# EAGLE schematic esp32buscam_02 (EAGLE 9.6.2)
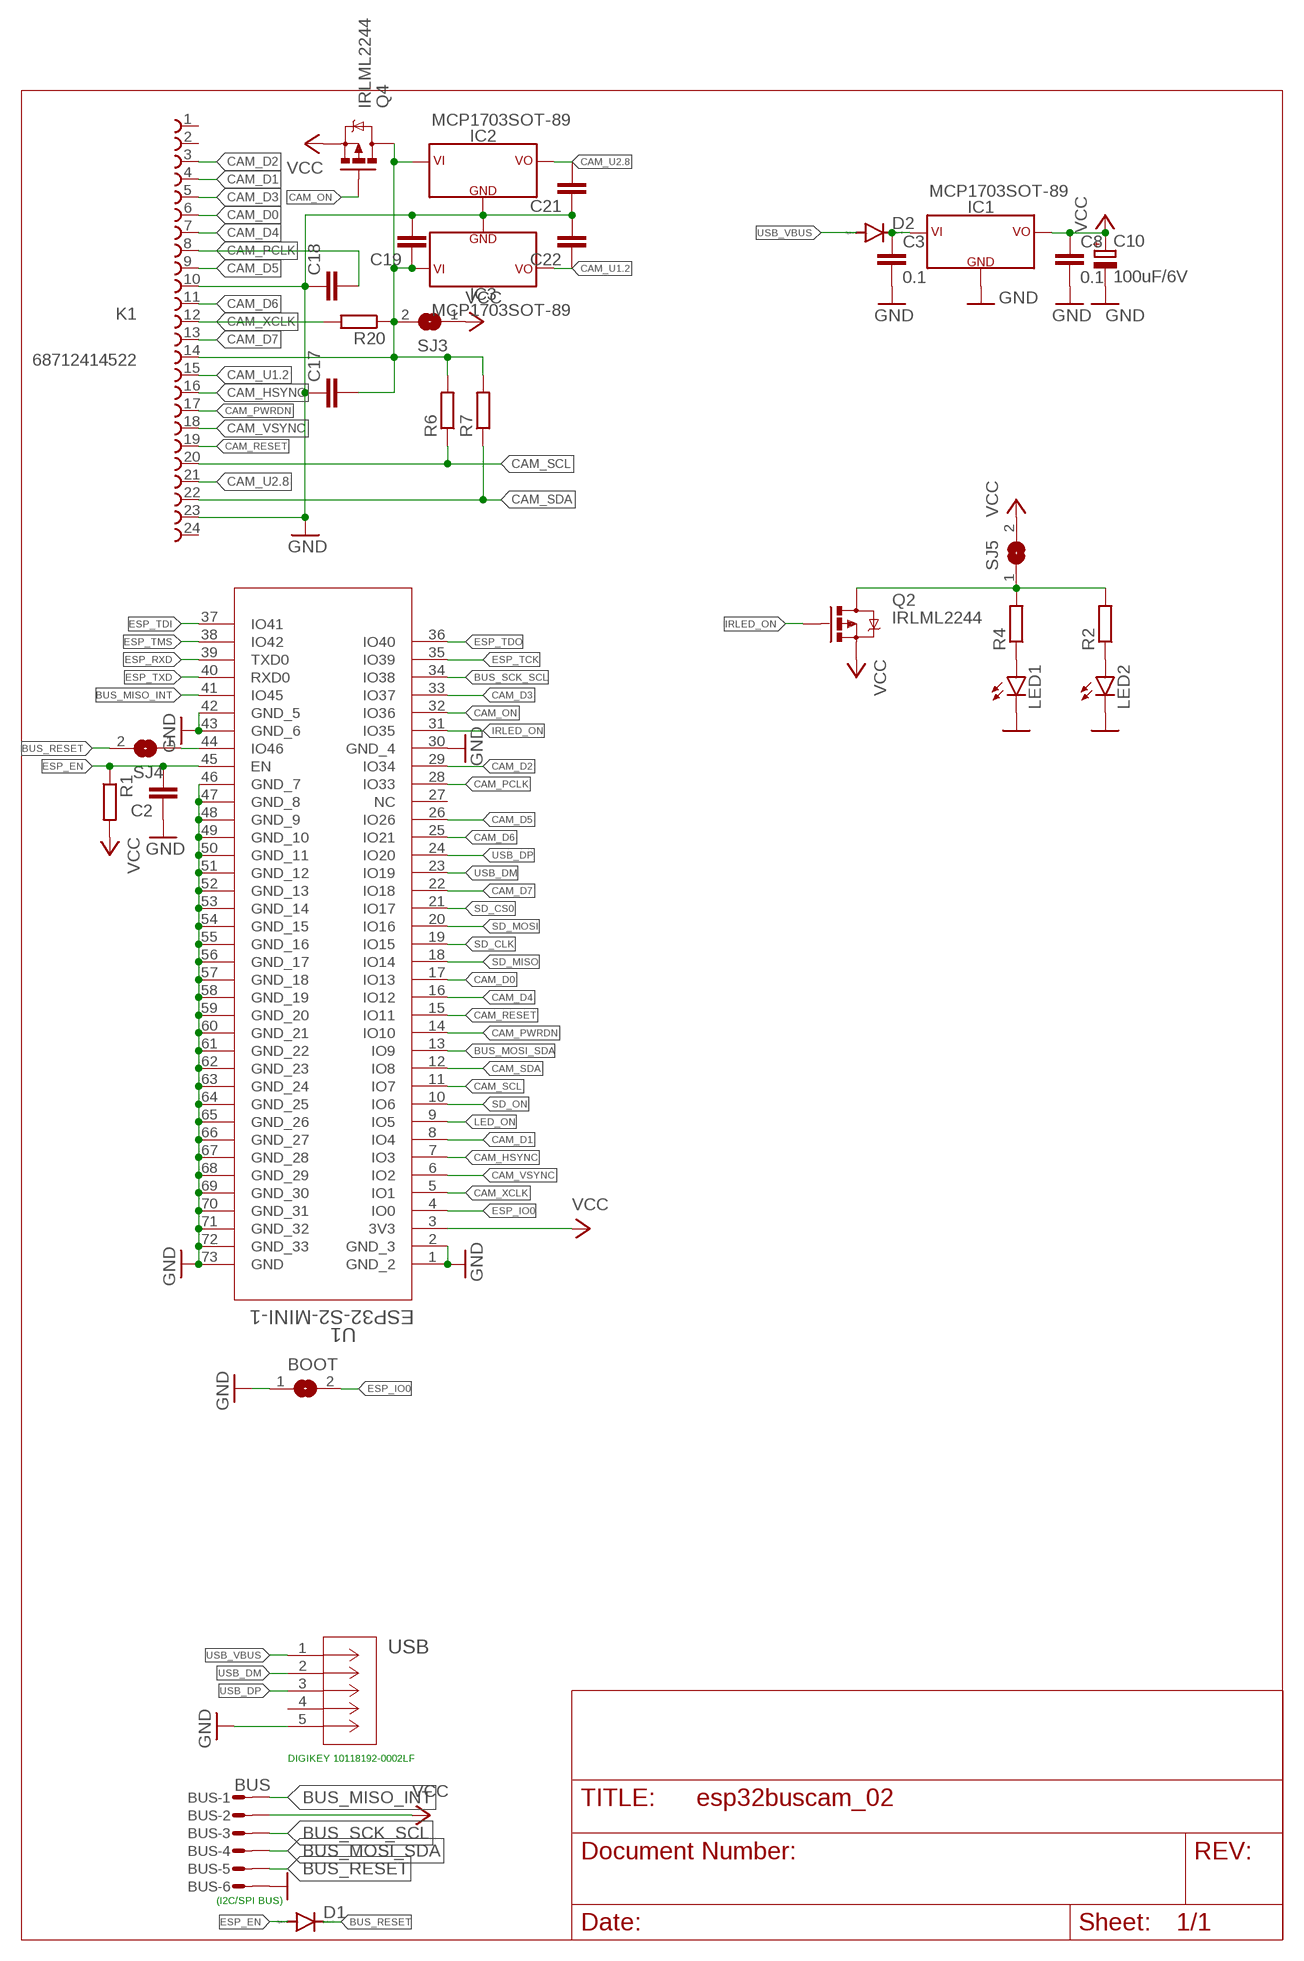
[diagram p0: schematic, sheet 1]

## Parts
BOOT  SJ  [SJ]
BUS  BUS  MICROMATCH-6SMD  [MICROMATCH-6SMD]
C2  C-EUC0603  [C0603]
C3  0.1  C-EUC0805  [C0805]
C8  0.1  C-EUC0805  [C0805]
C10  100uF/6V  CPOL-EUB/3528-21R  [B/3528-21R]
C17  C-EUC0603  [C0603]
C18  C-EUC0603  [C0603]
C19  C-EUC0603  [C0603]
C21  C-EUC0603  [C0603]
C22  C-EUC0603  [C0603]
D1  DIODE-MINIMELF  [MINIMELF]
D2  DIODE-MINIMELF  [MINIMELF]
IC1  MCP1703SOT-89  [SOT89]
IC2  MCP1703SOT-89  [SOT89]
IC3  MCP1703SOT-89  [SOT89]
K1  68712414522  [68712414522]
LED1  LED5MM  [LED5MM]
LED2  LED5MM  [LED5MM]
Q2  IRLML2244  MOSFET-PCHANNELIRLML2244  [SOT23-3]
Q4  IRLML2244  MOSFET-PCHANNELIRLML2244  [SOT23-3]
R1  R-EU_R0603  [R0603]
R2  R-EU_R0402  [R0402]
R4  R-EU_R0402  [R0402]
R6  R-EU_R0603  [R0603]
R7  R-EU_R0603  [R0603]
R20  R-EU_R0603  [R0603]
SJ3  SJ  [SJ]
SJ4  SJ  [SJ]
SJ5  SJ  [SJ]
U1  ESP32-S2-MINI-1  [QFN60_ESP32-S2-MINI-1_EXP]
USB  10118192-0002LF  [CONN_10118192-0002LF_AMP]

## Nets
BUS_MISO_INT: BUS.1 U1.41(IO45)
BUS_MOSI_SDA: BUS.4 U1.13(IO9)
BUS_RESET: BUS.5 D1.C SJ4.2
BUS_SCK_SCL: BUS.3 U1.34(IO38)
CAM_D0: K1.6 U1.17(IO13)
CAM_D1: K1.4 U1.8(IO4)
CAM_D2: K1.3 U1.29(IO34)
CAM_D3: K1.5 U1.33(IO37)
CAM_D4: K1.7 U1.16(IO12)
CAM_D5: K1.9 U1.26(IO26)
CAM_D6: K1.11 U1.25(IO21)
CAM_D7: K1.13 U1.22(IO18)
CAM_HSYNC: K1.16 U1.7(IO3)
CAM_ON: Q4.1(G) U1.32(IO36)
CAM_PCLK: C18.2 K1.8 U1.28(IO33)
CAM_PWRDN: K1.17 U1.14(IO10)
CAM_RESET: K1.19 U1.15(IO11)
CAM_SCL: K1.20 R6.1 U1.11(IO7)
CAM_SDA: K1.22 R7.1 U1.12(IO8)
CAM_U1.2: C22.1 IC3.3(VCC) K1.15
CAM_U2.8: C21.2 IC2.3(VCC) K1.21
CAM_VSYNC: K1.18 U1.6(IO2)
CAM_XCLK: K1.12 R20.2 U1.5(IO1)
ESP_EN: C2.2 D1.A R1.1 U1.45(EN)
ESP_IO0: BOOT.2 U1.4(IO0)
ESP_RXD: U1.39(TXD0)
ESP_TCK: U1.35(IO39)
ESP_TDI: U1.37(IO41)
ESP_TDO: U1.36(IO40)
ESP_TMS: U1.38(IO42)
ESP_TXD: U1.40(RXD0)
GND [gnd]: BOOT.1 BUS.6 C2.1 C3.2 C8.2 C10.- C17.1 C18.1 C19.2 C21.1 C22.2 IC1.1(GND) IC2.1(GND) IC3.1(GND) K1.10 K1.23 LED1.K(C) LED2.K(C) U1.1(GND_2) U1.2(GND_3) U1.30(GND_4) U1.42(GND_5) U1.43(GND_6) U1.46(GND_7) U1.47(GND_8) U1.48(GND_9) U1.49(GND_10) U1.50(GND_11) U1.51(GND_12) U1.52(GND_13) U1.53(GND_14) U1.54(GND_15) U1.55(GND_16) U1.56(GND_17) U1.57(GND_18) U1.58(GND_19) U1.59(GND_20) U1.60(GND_21) U1.61(GND_22) U1.62(GND_23) U1.63(GND_24) U1.64(GND_25) U1.65(GND_26) U1.66(GND_27) U1.67(GND_28) U1.68(GND_29) U1.69(GND_30) U1.70(GND_31) U1.71(GND_32) U1.72(GND_33) U1.73(GND) USB.5
IRLED_ON: Q2.1(G) U1.31(IO35)
LED_ON: U1.9(IO5)
N$1: LED1.A R4.1
N$2: SJ4.1 U1.44(IO46)
N$3: LED2.A R2.1
N$8: Q2.3(D) R2.2 R4.2 SJ5.1
SD_CLK: U1.19(IO15)
SD_CS0: U1.21(IO17)
SD_MISO: U1.18(IO14)
SD_MOSI: U1.20(IO16)
SD_ON: U1.10(IO6)
USB_DM: U1.23(IO19) USB.2
USB_DP: U1.24(IO20) USB.3
USB_VBUS [power]: D2.A USB.1
V [power]: C3.1 D2.C IC1.2(VIN) IC1.4(VIN)
VCC [power]: BUS.2 C8.1 C10.+ IC1.3(VCC) Q2.2(S) Q4.2(S) R1.2 SJ3.1 SJ5.2 U1.3(3V3)
VCC_CAM [power]: C17.2 C19.1 IC2.2(VIN) IC2.4(VIN) IC3.2(VIN) IC3.4(VIN) K1.14 Q4.3(D) R6.2 R7.2 R20.1 SJ3.2
Unconnected: K1.1 K1.2 K1.24 U1.27(NC) USB.4

## Notes on the sheet
- DIGIKEY 10118192-0002LF
- (I2C/SPI BUS)

## Library data of the parts
BOOT SJ3-SJ5 = jumper:SJ: SMD solder JUMPER
BUS = con-amp-micromatch:MICROMATCH-6: MicroMaTch 6 7-215464-6 / 0-215464-6 Drawing Number C-215464 DDEController.pdf
C2 C17-C19 C21 C22 = rcl:C-EU: CAPACITOR, European symbol; SPICEPREFIX: C
C3 C8 = rcl:C-EU: CAPACITOR, European symbol
C10 = rcl:CPOL-EU: POLARIZED CAPACITOR, European symbol
D1 D2 = diode:DIODE-: DIODE
IC1-IC3 = bytewerk-vreg:MCP1703
K1 = FPC_Connectors_Flat_Flexible_Cable_rev15c:68712414522: WE-FPC 0.5mm SMT ZIF Horizontal Bottom Contact, 24 Pins=>Code : Con_FPC_ZIF_0.50_68712414522 <http://katalog.we-online.de/media/images/eican/Con_FPC_ZIF_0.50_6871xx14522_pf2.jpg> Details see: http://katalog.we-online.de/en/em/687_1xx_145_22 Created 2014-07-09, Karrer Zheng 2014 (C) Würth Elektronik
LED1 LED2 = led:LED: LED OSRAM: - CHIPLED LG R971, LG N971, LY N971, LG Q971, LY Q971, LO R971, LY R971 LH N974, LH R974 LS Q976, LO Q976, LY Q976 LO Q996 - Hyper CHIPLED LW Q18S LB Q993, LB Q99A, LB R99A - SideLED LS A670, LO A670, LY A670, LG A670, LP A670 LB A673, LV A673, LT A673, LW A673 LH A674 LY A675 LS A676, LA A676, LO A676, LY A676, LW A676 LS A679, LY A679, LG A679 - Hyper Micro SIDELED® LS Y876, LA Y876, LO Y876, LY Y876 LT Y87S - SmartLED LW L88C, LW L88S LB L89C, LB L89S, LG L890 LS L89K, LO L89K, LY L89K LS L896, LA L896, LO L896, LY L896 - TOPLED LS T670, LO T670, LY T670, LG T670, LP T670 LSG T670, LSP T670, LSY T670, LOP T670, LYG T670 LG T671, LOG T671, LSG T671 LB T673, LV T673, LT T673, LW T673 LH T674 LS T676, LA T676, LO T676, LY T676, LB T676, LH T676, LSB T676, LW T676 LB T67C, LV T67C, LT T67C, LS T67K, LO T67K, LY T67K, LW E67C LS E67B, LA E67B, LO E67B, LY E67B, LB E67C, LV E67C, LT E67C LW T67C LS T679, LY T679, LG T679 LS T770, LO T770, LY T770, LG T770, LP T770 LB T773, LV T773, LT T773, LW T773 LH T774 LS E675, LA E675, LY E675, LS T675 LS T776, LA T776, LO T776, LY T776, LB T776 LHGB T686 LT T68C, LB T68C - Hyper Mini TOPLED® LB M676 - Mini TOPLED Santana® LG M470 LS M47K, LO M47K, LY M47K Source: http://www.osram.convergy.de LUXEON: - LUMILED® LXK2-PW12-R00, LXK2-PW12-S00, LXK2-PW14-U00, LXK2-PW14-V00 LXK2-PM12-R00, LXK2-PM12-S00, LXK2-PM14-U00 LXK2-PE12-Q00, LXK2-PE12-R00, LXK2-PE12-S00, LXK2-PE14-T00, LXK2-PE14-U00 LXK2-PB12-K00, LXK2-PB12-L00, LXK2-PB12-M00, LXK2-PB14-N00, LXK2-PB14-P00, LXK2-PB14-Q00 LXK2-PR12-L00, LXK2-PR12-M00, LXK2-PR14-Q00, LXK2-PR14-R00 LXK2-PD12-Q00, LXK2-PD12-R00, LXK2-PD12-S00 LXK2-PH12-R00, LXK2-PH12-S00 LXK2-PL12-P00, LXK2-PL12-Q00, LXK2-PL12-R00 Source: www.luxeon.com KINGBRIGHT: KA-3528ASYC Source: www.kingbright.com
Q2 Q4 = User-Submitted:MOSFET-PCHANNEL: Generic PMOSFET IRLML2244 - TRANS-11153 (SOT-23 -20V -4.3A) (1.Gate 2.Source 3.Drain) FQP27P06 - COM-10349 <http://www.sparkfun.com/products/10349> (TO-220 -60V -27A) (1.Gate 2.Source 3.Drain); PROD_ID: TRANS-11153
R1 R2 R4 R6 R7 R20 = rcl:R-EU_: RESISTOR, European symbol; SPICEPREFIX: R
U1 = esp32s2mini:ESP32-S2-MINI-1; BUILT_BY: EMA_Kyle; COPYRIGHT: Copyright (C) 2018 Accelerated Designs. All rights reserved; DATASHEET: https://www.espressif.com/sites/default/files/documentation/esp32-s2-mini-1_esp32-s2-mini-1u_datasheet_en.pdf; MANUFACTURER_PART_NUMBER: ESP32-S2-MINI-1; SOURCELIBRARY: Add_to_database_2020-11-03; VENDOR: Espressif Systems
USB = esp32s2mini:10118192-0002LF; BUILT_BY: EMA_Cory; COPYRIGHT: Copyright (C) 2018 Accelerated Designs. All rights reserved; DATASHEET: https://www.amphenol-icc.com/media/wysiwyg/files/drawing/10118192.pdf; MANUFACTURER_PART_NUMBER: 10118192-0002LF; SOURCELIBRARY: Amphenol_ICC_2020-05-19; VENDOR: Amphenol

## Net classes
0 default: width 0.089 mm, drill 0.2 mm
1 gnd: width 0.254 mm, drill 0.2 mm
2 power: width 0.254 mm, drill 0.2 mm